# Altium schematic sheet so_do_nguyen_ly.SchDoc
size A4
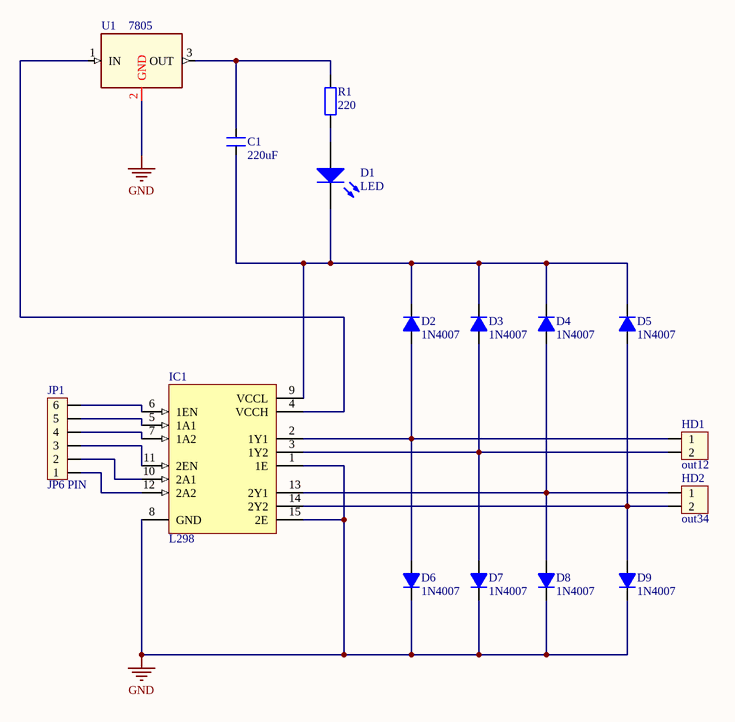
[diagram p0: so_do_nguyen_ly.SchDoc]

## Parts
C1  220uF  [CN1.5]
D1  LED  [LED-0 3mm RED]
D2  1N4007  [D2A]
D3  1N4007  [D2A]
D4  1N4007  [D2A]
D5  1N4007  [D2A]
D6  1N4007  [D2A]
D7  1N4007  [D2A]
D8  1N4007  [D2A]
D9  1N4007  [D2A]
HD1  out12  [HED2]
HD2  out34  [HED2]
IC1  L298  [DIP15SL2]
JP1  JP6 PIN  [JP6]
R1  220  [R1/4W]
U1  LM78xx  [TO-220]  (value not drawn)

## Nets
GND: D6.2(K) D7.2(K) D8.2(K) D9.2(K) IC1.1(1E) IC1.8(GND) IC1.15(2E) U1.2(GND)
NetC1_1: C1.1 D1.2(K) D2.2(K) D3.2(K) D4.2(K) D5.2(K) IC1.9(VCCL)
NetC1_2: C1.2 R1.2 U1.3(OUT)
NetD1_1: D1.1(A) R1.1
NetD2_1: D2.1(A) D6.1(A) HD1.1 IC1.2(1Y1)
NetD3_1: D3.1(A) D7.1(A) HD1.2 IC1.3(1Y2)
NetD4_1: D4.1(A) D8.1(A) HD2.1 IC1.13(2Y1)
NetD5_1: D5.1(A) D9.1(A) HD2.2 IC1.14(2Y2)
NetIC1_4: IC1.4(VCCH) U1.1(IN)
NetIC1_5: IC1.5(1A1) JP1.5
NetIC1_6: IC1.6(1EN) JP1.6
NetIC1_7: IC1.7(1A2) JP1.4
NetIC1_10: IC1.10(2A1) JP1.2
NetIC1_11: IC1.11(2EN) JP1.3
NetIC1_12: IC1.12(2A2) JP1.1

## Notes on the sheet
- (near U1) 7805

## Library data of the parts
C1 = CN1.5: Cap np 682pF => 104pF; Value: 0.01uF
D1 = LED: Typical LED; Published: 8-Jun-2000; LatestRevisionDate: 08-Jul-2005; LatestRevisionNote: Mech Layer 1 removed.; PackageReference: LED-1; Publisher: Altium Limited
D2-D9 = D1A: Diode 1A; Value: 1N4007
HD1 HD2 = Hed2: Header 2 (Green); Value: Header 2
IC1 = L298: Dual Full-H Driver; Note: The tab is elec is connected to GND pin; Published: 15-May-2002; DatasheetVersion: Jun-1990; PackageReference: KV015; Publisher: Altium Limited; PackageDescription: TO, Thru-Hole, Vertical, Heatsink Mounted; 15 Bent Staggered Leads; Pitch 1.27 mm; ComponentLink1Description: Manufacturer Link; ComponentLink1URL: http://www.ti.com/
JP1 = JP6: Value: JP7
R1 = R1/4W: Resistor 1/4W; Value: R1/4W - 1K
U1 = LM78xx: Regulator; Manufacturer: Fairchild Semiconductor Corporation; PSpiceTemplate: X^@REFDES %IN %OUT %GND @MODEL; Vendor: Digikey; Output Current: Up to 1A; V out: 5V; Tolerance: 4 %; Value: LM7805CT; Published: 13-April-2009; Publisher: Hoang Nguyen; ComponentLink1Description: Digikey Part Link; ComponentLink2Description: Open Datasheet; ComponentLink2URL: H:\LIBRARY\LIBRARY.Datasheet\LM7805.pdf; Price: 2500 VND